# EAGLE design ACNodeShield (EAGLE 6.1)
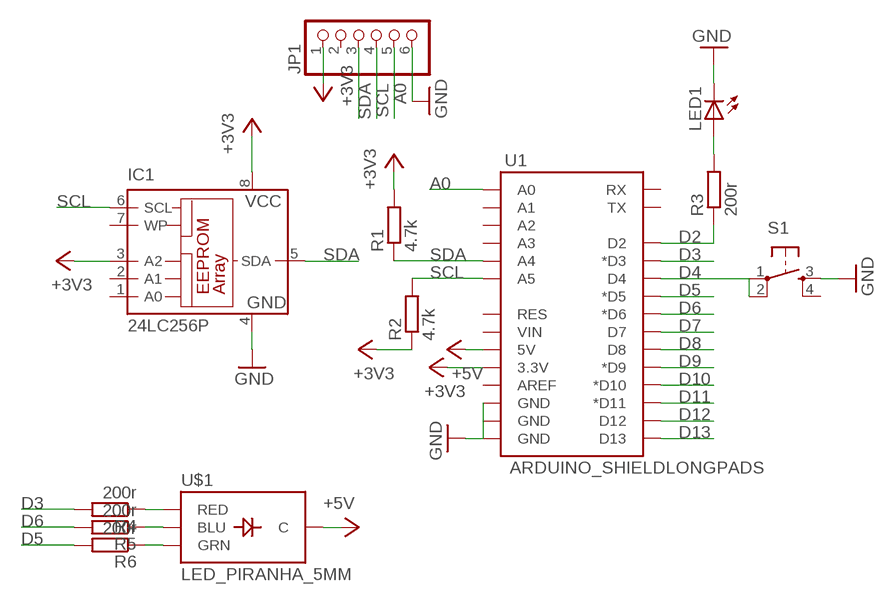
[diagram p0: schematic, sheet 1]

## Parts
IC1  24LC256P  [DIL8]
JP1  PINHD-1X6  [1X06]
LED1  LED5MM  [LED5MM]
R1  4.7k  R-EU_0204/7  [0204/7]
R2  4.7k  R-EU_0204/7  [0204/7]
R3  200r  R-EU_0204/7  [0204/7]
R4  200r  R-EU_0204/7  [0204/7]
R5  200r  R-EU_0204/7  [0204/7]
R6  200r  R-EU_0204/7  [0204/7]
S1  TAC_SWITCHPTH  [TACTILE-PTH]
U1  ARDUINO_SHIELDLONGPADS  [DUEMILANOVE_SHIELD_LONGPADS]
U$1  LED_PIRANHA_5MM  [LED_PIRANHA_5MM]

## Nets
+3V3: IC1.3(A2) IC1.8(VCC) JP1.1 R1.2 R2.1 U1.3.3V
+5V: U1.5V U$1.-(C)
A0: JP1.5 U1.A0
D2: R3.1 U1.D2
D3: R4.2 U1.D3(*D3)
D4: S1.1 S1.2 U1.D4
D5: R6.2 U1.D5(*D5)
D6: R5.2 U1.D6(*D6)
D7: U1.D7
D8: U1.D8
D9: U1.D9(*D9)
D10: U1.D10(*D10)
D11: U1.D11(*D11)
D12: U1.D12
D13: U1.D13
GND: IC1.4(GND) JP1.6 LED1.K(C) S1.3 U1.GND@0(GND) U1.GND@1(GND) U1.GND@2(GND)
N$1: R4.1 U$1.R(RED)
N$2: LED1.A R3.2
N$3: R5.1 U$1.B(BLU)
N$4: R6.1 U$1.G(GRN)
SCL: IC1.6(SCL) JP1.4 R2.2 U1.A5
SDA: IC1.5(SDA) JP1.3 R1.1 U1.A4
Unconnected: IC1.1(A0) IC1.2(A1) IC1.7(WP) JP1.2 S1.4 U1.A1 U1.A2 U1.A3 U1.AREF U1.RES U1.RX U1.TX U1.VIN

## Library data of the parts
IC1 = microchip:24*: Serial EEPROM I2C; MF: MICROCHIP; MPN: 24LC256-E/P; OC_FARNELL: 9757970; OC_NEWARK: 92C7169
JP1 = pinhead:PINHD-1X6: PIN HEADER
LED1 = SparkFun-LED:LED: LEDs Standard schematic elements and footprints for 5mm, 3mm, 1206, and 0603 sized LEDs. 5mm - Spark Fun Electronics SKU : COM-00529 (and others)
R1-R6 = resistor:R-EU_: RESISTOR, European symbol
S1 = SparkFun-Electromechanical:TAC_SWITCH: Momentary Switch Button commonly used for reset or general input. Spark Fun Electronics SKU : COM-00097
U1 = SparkFun-Boards:ARDUINO_SHIELD: Arduino shield footprint
U$1 = SparkFun-LED:LED_PIRANHA_5MM: High-brightness RGB through-hole LED, similar to that used in the Shiftbrite

## Board
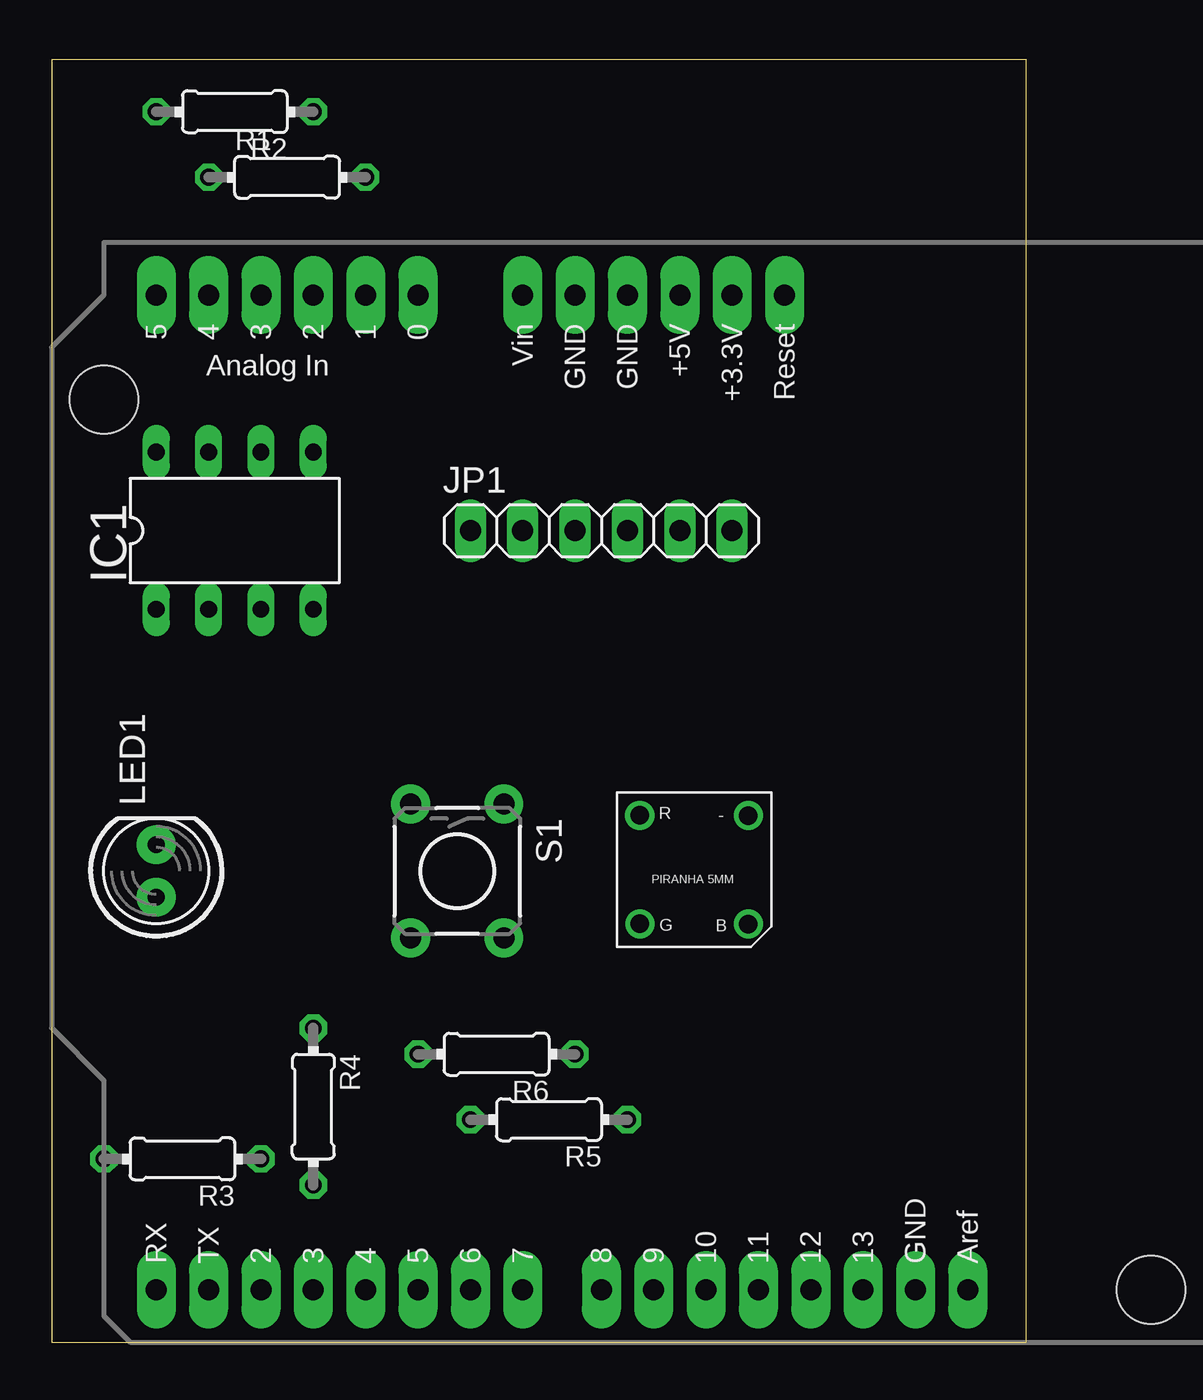
[diagram p1: board, top side]
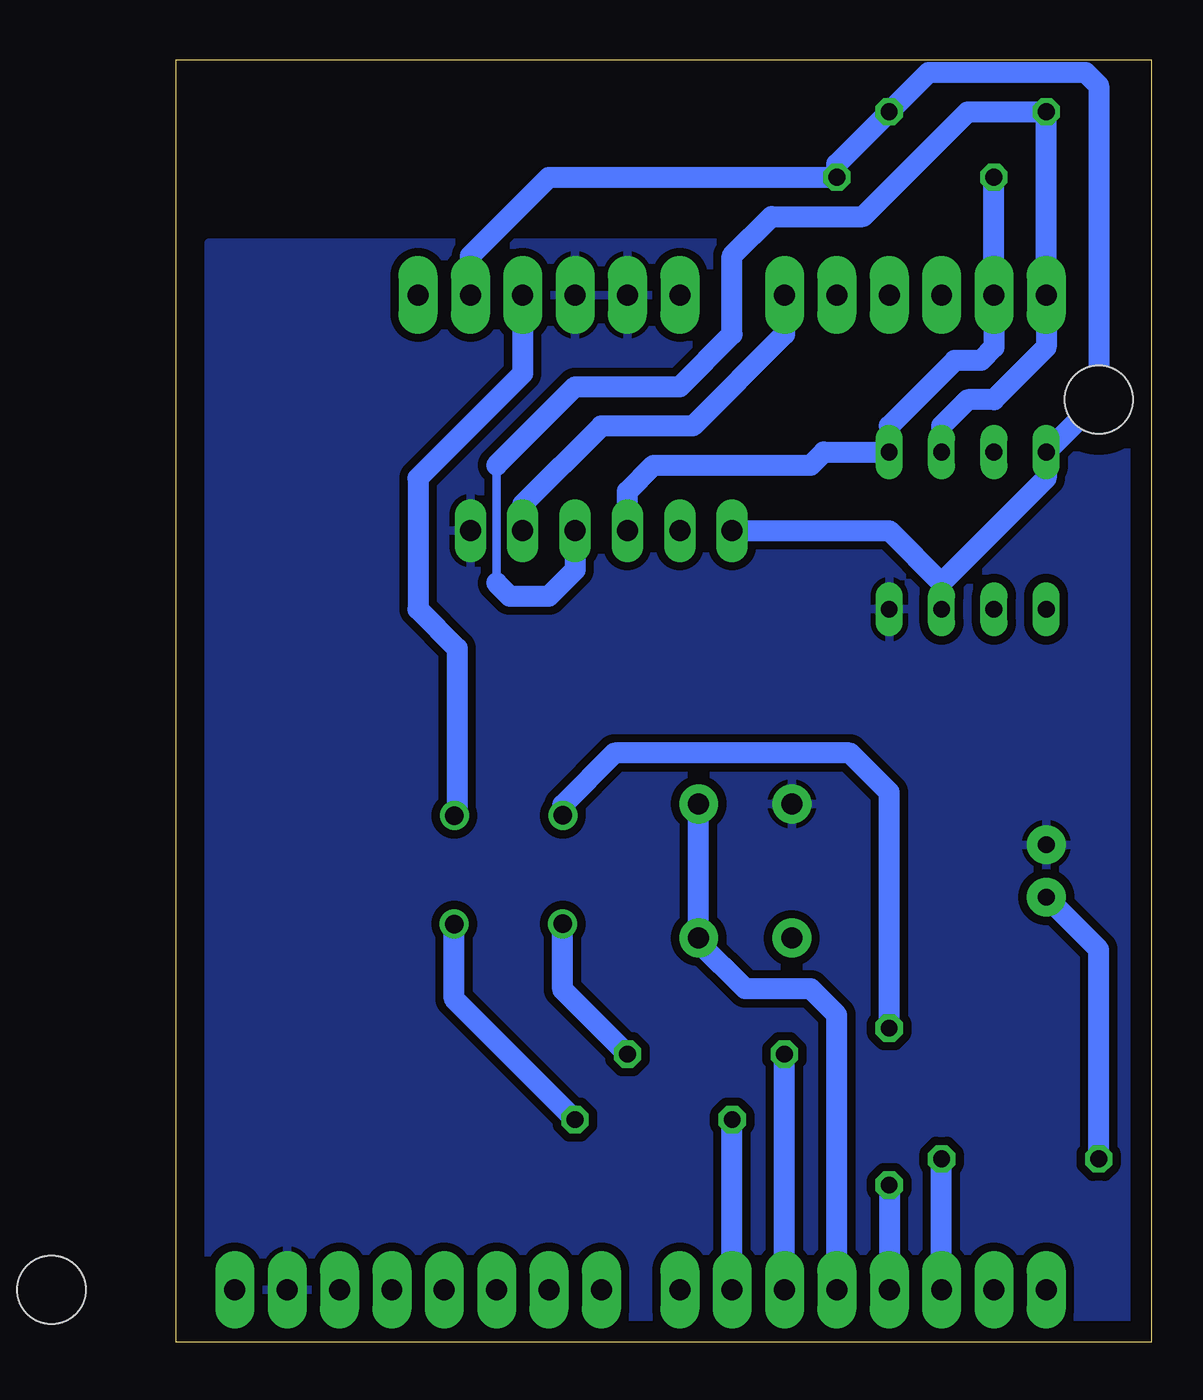
[diagram p2: board, bottom side, seen from below]

Size 47.3 x 62.22 mm. Coordinates in mm from the lower left corner, seen from the top.
Outline: 0,0 47.3,0 47.3,62.22 0,62.22 0,0
Copper layers (1*16): Top 0.035mm / dielectric 1.5mm / Bottom 0.035mm
Design rules: minimum track width 10mil, minimum drill 24mil, track to track 8mil, track to pad 8mil, pad to pad 8mil, via to via 8mil, smd to smd 8mil, copper to edge 40mil, drill to drill 8mil, minimum pad ring 10mil, minimum via ring 8mil, stop-mask expansion 4mil, vias tented up to drill 0mil, thermal gap 10mil

### Footprints (pad centres in the part's own frame; a part is rotated, then mirrored left to right if it is on the bottom)
DIL8 = drill 0.813 long: 1 -3.81,-3.81; 2 -1.27,-3.81; 3 1.27,-3.81; 4 3.81,-3.81; 5 3.81,3.81; 6 1.27,3.81; 7 -1.27,3.81; 8 -3.81,3.81
1X06 = drill 1.016 long: 1 -6.35,0; 2 -3.81,0; 3 -1.27,0; 4 1.27,0; 5 3.81,0; 6 6.35,0
LED5MM = drill 0.813 pad 1.88: A -1.27,0; K 1.27,0
0204/7 = drill 0.813 octagon: 1 -3.81,0; 2 3.81,0
TACTILE-PTH = drill 1.016 pad 1.88: 1 -3.251,2.261; 2 3.251,2.261; 3 -3.251,-2.261; 4 3.251,-2.261
DUEMILANOVE_SHIELD_LONGPADS = drill 1.016 pad 1.88 long: 3.3V 50.8,26.67; 5V 50.8,29.21; A0 50.8,41.91; A1 50.8,44.45; A2 50.8,46.99; A3 50.8,49.53; A4 50.8,52.07; A5 50.8,54.61; AREF 2.54,15.24; D2 2.54,49.53; D3 2.54,46.99; D4 2.54,44.45; D5 2.54,41.91; D6 2.54,39.37; D7 2.54,36.83; D8 2.54,33.02; D9 2.54,30.48; D10 2.54,27.94; D11 2.54,25.4; D12 2.54,22.86; D13 2.54,20.32; GND@0 50.8,31.75; GND@1 50.8,34.29; GND@2 2.54,17.78; RES 50.8,24.13; RX 2.54,54.61; TX 2.54,52.07; VIN 50.8,36.83 | hole 3.302: 45.72,57.15; 2.54,6.35
LED_PIRANHA_5MM = drill 0.9: - -2.684,-2.684; B -2.688,2.574; G 2.575,2.562; R 2.579,-2.696

### Placement (x,y rotation side)
IC1  8.89,39.37 0 top
JP1  26.67,39.37 0 top
LED1  5.08,22.86 90 top
R1  11.43,56.52 0 top
R2  8.89,59.69 180 top
R3  6.35,8.89 180 top
R4  12.7,11.43 270 top
R5  24.13,10.79 180 top
R6  21.59,13.97 180 top
S1  19.68,22.86 270 top
U1  59.69,0 90 top
U$1  31.11,22.86 180 top

### Tracks (layer width: path | path; a pad name or v marks a point on that pad's centre or on a via)
+3V3
  Bottom 1.016: 10.16,36.83 5.08,41.91 IC1.8 2.54,45.72 2.54,60.96 3.17,61.59 10.79,61.59 R2.1 15.24,57.15 R1.2 29.21,56.52 33.02,52.7 U1.3.3V | 10.16,36.83 IC1.3 | JP1.1 12.7,39.37 10.16,36.83
+5V
  Bottom 1.016: U1.5V 30.48,46.99 35.56,41.91 35.56,35.56 33.66,33.66 33.66,25.4 U$1.-
A0
  Bottom 1.016: U1.A0 17.78,48.9 22.23,44.45 26.67,44.45 30.48,40.64 JP1.5
D2
  Bottom 1.016: U1.D2 R3.1
D3
  Bottom 1.016: R4.2 U1.D3
D4
  Bottom 1.016: S1.1 S1.2 21.95,19.41 19.68,17.14 16.51,17.14 15.24,15.88 U1.D4
D5
  Bottom 1.016: U1.D5 R6.2
D6
  Bottom 1.016: U1.D6 R5.2
GND
  pour Bottom (isolate 0.406): 0,0 45.72,0 45.72,53.34 0,53.34
N$1
  Bottom 1.016: R4.1 12.7,26.67 14.61,28.57 26.04,28.57 28.54,26.07 U$1.R
N$2
  Bottom 1.016: R3.2 2.54,19.05 LED1.A
N$3
  Bottom 1.016: R5.1 33.8,16.66 U$1.B
N$4
  Bottom 1.016: R6.1 28.54,17.11 U$1.G
SCL
  Bottom 0.406: 31.75,42.55 31.75,36.83
  Bottom 1.016: IC1.6 10.16,44.45 8.89,45.72 7.62,45.72 5.08,48.26 U1.A5 R2.2 8.89,59.69 13.97,54.61 18.41,54.61 20.32,52.7 20.32,48.9 22.86,46.35 27.94,46.35 31.75,42.55 | JP1.4 27.94,37.47 29.21,36.2 31.11,36.2 31.75,36.83
SDA
  Bottom 1.016: R1.1 U1.A4 7.62,48.26 8.26,47.62 9.53,47.62 12.7,44.45 IC1.5 15.88,43.18 16.51,42.55 24.13,42.55 25.4,41.27 JP1.3